# Altium project PCB_Project1.PrjPCB
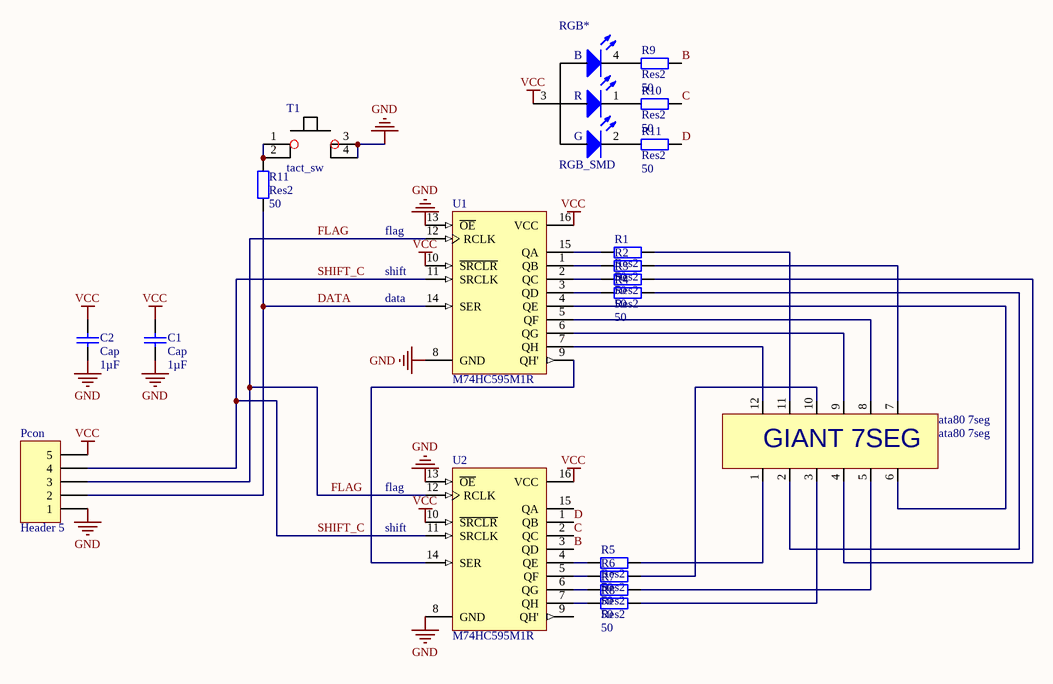
[diagram p0: display.SchDoc]
1 sheet, 20 parts. Net scope: global (net labels, ports and power ports of the same name join across sheets).
Board file: PCB1.PcbDoc

## Sheet display.SchDoc
size A4

### Parts
(Parts that share a designator on the sheet are numbered #1, #2 ... from top to bottom, then left to right.)
ata80_7seg  ata80 7seg  [7seg_foot]
C1  Cap  value 1µF  [C1206]
C2  Cap  value 1µF  [C1206]
Pcon  Header 5  [HDR1X5]
R1  Res2  value 50  [C1206]
R2  Res2  value 50  [C1206]
R3  Res2  value 50  [C1206]
R4  Res2  value 50  [C1206]
R5  Res2  value 50  [C1206]
R6  Res2  value 50  [C1206]
R7  Res2  value 50  [C1206]
R8  Res2  value 50  [C1206]
R9  Res2  value 50  [C1206]
R10  Res2  value 50  [C1206]
R11#1  Res2  value 50  [C1206]
R11#2  Res2  value 50  [C1206]
RGB*  RGB_SMD  [SMD_RGB]
T1  tact_sw  [pcb_sw]
U1  M74HC595M1R  [SO16_N]
U2  M74HC595M1R  [SO16_N]

### Nets
GND: C1.1 C2.1 Pcon.1 T1.3 T1.4 U1.8(GND) U1.13(~{OE}) U2.8(GND) U2.13(~{OE})
VCC: C1.2 C2.2 Pcon.5 RGB*.3(A) U1.10(~{SRCLR}) U1.16(VCC) U2.10(~{SRCLR}) U2.16(VCC)
B: R9.2 U2.3(QD)
C: R10.2 U2.2(QC)
D: R11#1.2 U2.1(QB)
DATA: Pcon.2 R11#2.1 U1.14(SER)
FLAG: Pcon.3 U1.12(RCLK) U2.12(RCLK)
SHIFT_C: Pcon.4 U1.11(SRCLK) U2.11(SRCLK)
Netata80_7seg_1: ata80_7seg.1 R5.2
Netata80_7seg_2: ata80_7seg.2 R4.2
Netata80_7seg_3: ata80_7seg.3 R8.2
Netata80_7seg_4: ata80_7seg.4 R3.2
Netata80_7seg_5: ata80_7seg.5 R7.2
Netata80_7seg_6: ata80_7seg.6 U1.4(QE)
Netata80_7seg_7: ata80_7seg.7 R2.2
Netata80_7seg_8: ata80_7seg.8 U1.5(QF)
Netata80_7seg_9: ata80_7seg.9 U1.6(QG)
Netata80_7seg_10: ata80_7seg.10 R6.2
Netata80_7seg_11: ata80_7seg.11 R1.2
Netata80_7seg_12: ata80_7seg.12 U1.7(QH)
NetR1_1: R1.1 U1.15(QA)
NetR2_1: R2.1 U1.1(QB)
NetR3_1: R3.1 U1.2(QC)
NetR4_1: R4.1 U1.3(QD)
NetR5_1: R5.1 U2.4(QE)
NetR6_1: R6.1 U2.5(QF)
NetR7_1: R7.1 U2.6(QG)
NetR8_1: R8.1 U2.7(QH)
NetR9_1: R9.1 RGB*.4(K)
NetR10_1: R10.1 RGB*.1(R)
NetR11#1_1: R11#1.1 RGB*.2(K)
NetR11#2_2: R11#2.2 T1.1 T1.2
NetU1_9: U1.9(QH') U2.14(SER)

Not connected (* = marked no-connect by the designer): U2 9(QH') 15(QA)

### Notes on the sheet
- (near U1) flag
- (near U1) shift
- (near U1) data
- (near U2) flag
- (near U2) shift
- (in symbol ata80 7seg) GIANT 7SEG
- (in symbol RGB_SMD) B; G

### Library data of the parts
C1 C2 = Cap: Capacitor; Published: 8-Jun-2000; LatestRevisionDate: 17-Jul-2002; LatestRevisionNote: Re-released for DXP Platform.; PackageReference: RAD-0.3; Publisher: Altium Limited; PackageDescription: Radial Cap, Thru-Hole; 2 Leads; 0.3 in Pin Spacing
Pcon = Header 5: Header, 5-Pin; LatestRevisionDate: 17-Jul-2002; LatestRevisionNote: Re-released for DXP Platform.; Publisher: Altium Limited
R1-R10 R11#1 R11#2 = Res2: Resistor; Published: 8-Jun-2000; LatestRevisionDate: 17-Jul-2002; LatestRevisionNote: Re-released for DXP Platform.; PackageReference: AXIAL-0.4; Publisher: Altium Limited; PackageDescription: Axial Device, Thru-Hole; 2 Leads; 0.4 in Pin Spacing
T1 = tact_sw: pin to pad: 2>1 3>2 4>2
U1 U2 = M74HC595M1R: 8 Bit Shift Register with Output Latches (3 STATE); Published: 8-Jun-2000; LatestRevisionDate: 13-Apr-2006; LatestRevisionNote: IPC-7351 Footprint Added.; DatasheetVersion: Apr-1993; PackageVersion: May-1998; PackageReference: SO16; Publisher: Altium Limited; PackageDescription: 16-Pin Small Outline Integrated Circuit 1.27 mm Pitch; Code_IPC: SOIC127P600-16; ComponentLink1Description: Manufacturer Link; ComponentLink1URL: http://www.st.com/; ComponentLink2Description: Datasheet; ComponentLink2URL: http://www.st.com/stonline/products/literature/ds/1989/m74hc595.pdf